# EasyEDA schematic SCH_DART-Flight-Computer-4_2024-07-14.json
TITLE: DART Flight Computer; REV: 4; Date: 2024-07-12; Sheet: 1/1; Drawn By: Jack O'Hara; Company: DART
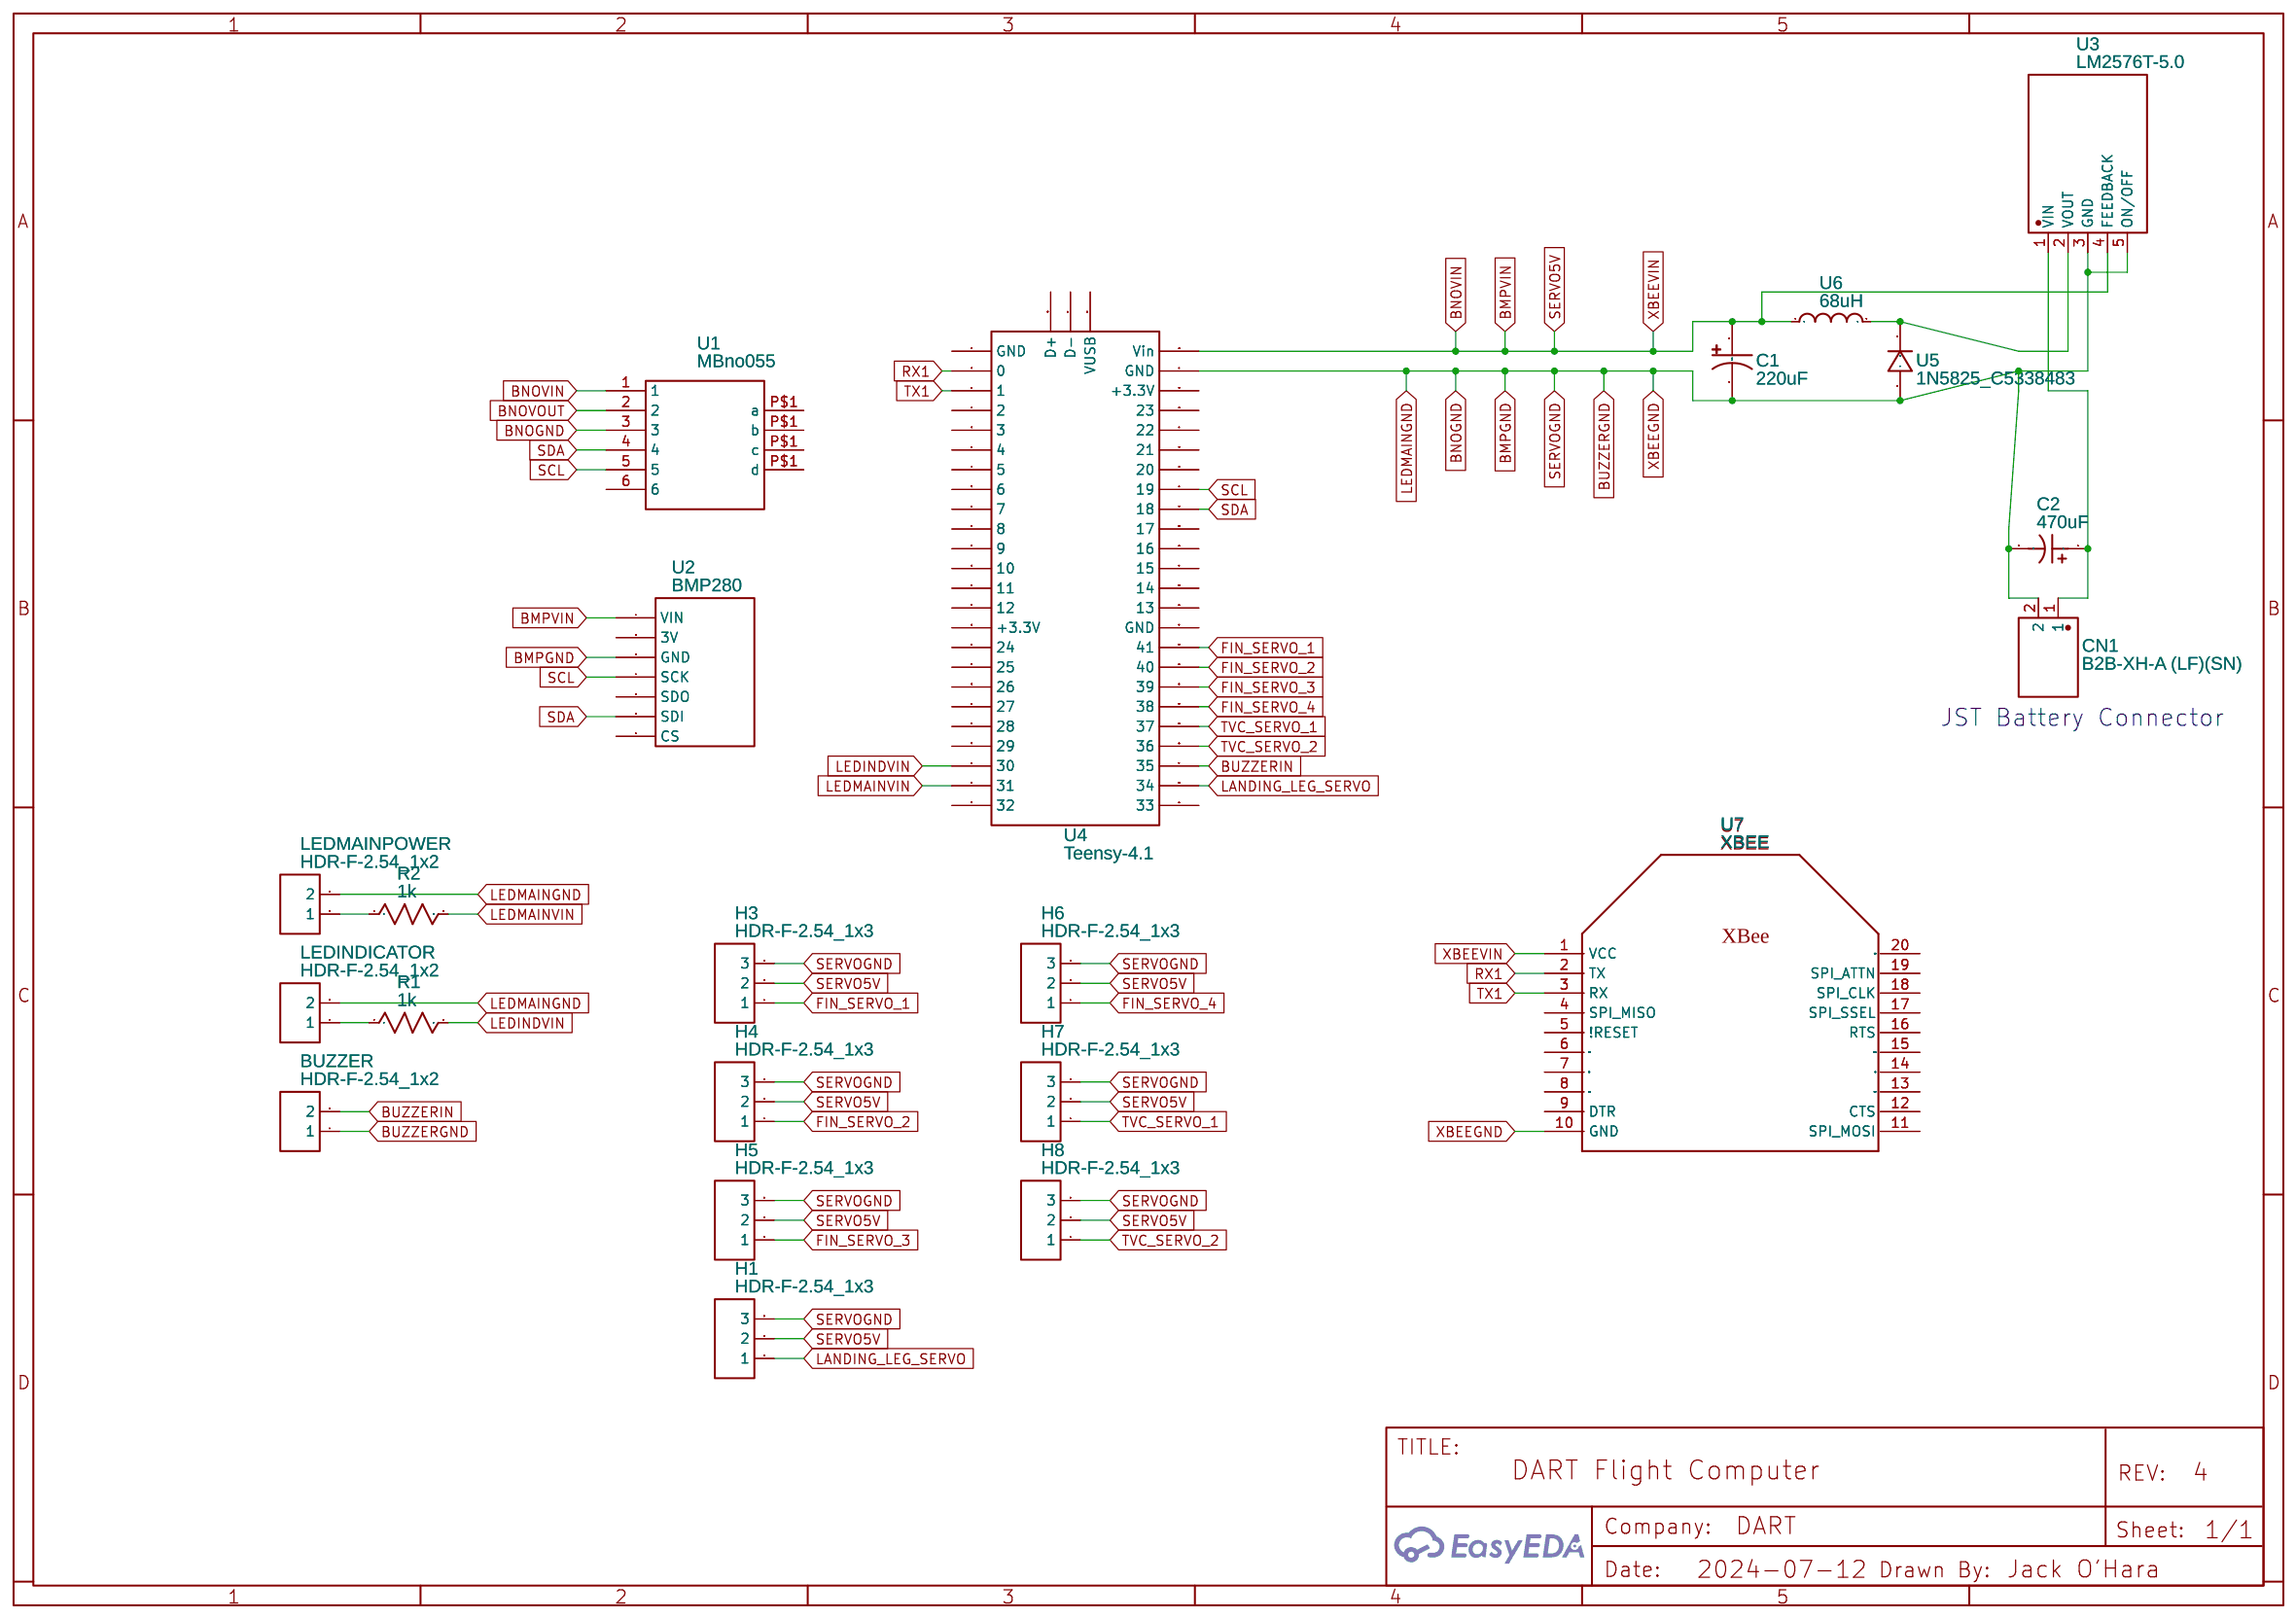
[diagram p0: schematic sheet]

## Parts
BUZZER  HDR-F-2.54_1x2  [HDR-F-2.54_1X2]
C1  220uF  [CAP-TH_BD8.0-P3.50-D0.6-FD]
C2  470uF  [CAP-TH_BD8.0-P3.50-D0.6-FD]
CN1  B2B-XH-A (LF)(SN)  [CONN-TH_B2B-XH-A-LF-SN]
H1  HDR-F-2.54_1x3  [HDR-F-2.54_1X3]
H3  HDR-F-2.54_1x3  [HDR-F-2.54_1X3]
H4  HDR-F-2.54_1x3  [HDR-F-2.54_1X3]
H5  HDR-F-2.54_1x3  [HDR-F-2.54_1X3]
H6  HDR-F-2.54_1x3  [HDR-F-2.54_1X3]
H7  HDR-F-2.54_1x3  [HDR-F-2.54_1X3]
H8  HDR-F-2.54_1x3  [HDR-F-2.54_1X3]
LEDINDICATOR  HDR-F-2.54_1x2  [HDR-F-2.54_1X2]
LEDMAINPOWER  HDR-F-2.54_1x2  [HDR-F-2.54_1X2]
R1  1k  [R0603]
R2  1k  [R0603]
U1  MBno055  [MBNO055]
U2  BMP280  [BMP280YSF BMP280YSF BMP280YSF BMP]
U3  LM2576T-5.0  [TO-220-5L_L10.2-W4.5-P1.71-L]
U4  Teensy-4.1  [TEENSY-4.1-ALL-PINS]
U5  1N5825_C5338483  [DO-201AD_BD5.0-L9.0-P13.00-D1.0]
U6  68uH  [IND-SMD_L12.0-W12.0_SLH1207S100MTT]
U7  XBEE  [XBEE]

## Library data of the parts
BUZZER LEDINDICATOR LEDMAINPOWER = HDR-F-2.54_1x2: Supplier Part: C49661; Supplier: LCSC; Contributor: LCEDA_Lib
C1 = UPW1E221MPD: Contributor: LCSC; Supplier: LCSC; Supplier Part: C225867; Manufacturer: Nichicon(尼吉康); JLCPCB Part Class: Extended Part
C2 = 152EC0399: Supplier: LCSC; Supplier Part: C6718380; Manufacturer: KNSCHA(科尼盛); Contributor: lcsc
CN1 = B2B-XH-A (LF)(SN): Contributor: LCSC; Supplier: LCSC; Supplier Part: C158012; Manufacturer: JST; Manufacturer Part: B2B-XH-A(LF)(SN); JLCPCB Part Class: Extended Part
H1 H3-H8 = HDR-F-2.54_1x3: Supplier Part: C146690; Supplier: LCSC; Contributor: LCEDA_Lib
R1 R2 = R_0603_US: Contributor: LCEDA_Lib
U1 = MBno055: Contributor: ilerimstf.95
U2 = BMP280: Contributor: Calibre320
U3 = LM2576T-5.0: Contributor: LCSC; Supplier: LCSC; Manufacturer: HTC; Supplier Part: C126042; JLCPCB Part Class: Extended Part
U4 = Teensy-4.1: Contributor: vosegaard
U5 = 1N5825_C5338483: Contributor: lcsc; Supplier: LCSC; Supplier Part: C5338483; Manufacturer: SUNMATE(森美特); Manufacturer Part: 1N5825; JLCPCB Part Class: Extended Part
U6 = SRR1210-680M: Supplier: LCSC; Supplier Part: C2041823; Manufacturer: BOURNS; JLCPCB Part Class: Extended Part; Contributor: lcsc
U7 = XBEE: Contributor: signx

## Nets
BMPGND: BUZZER.1 C1.2 C2.2 CN1.2 H1.3 H3.3 H4.3 H5.3 H6.3 H7.3 H8.3 LEDINDICATOR.2 LEDMAINPOWER.2 U1.3 U2.5(GND) U3.3(GND) U3.5(ON/OFF) U4.47(GND) U5.2(A) U7.10(GND)
BMPVIN: C1.1 H1.2 H3.2 H4.2 H5.2 H6.2 H7.2 H8.2 U1.1 U2.7(VIN) U3.4(FEEDBACK) U4.48(Vin) U6.1 U7.1(VCC)
BNOVOUT: U1.2
BUZZERIN: BUZZER.2 U4.27(35)
FIN_SERVO_1: H3.1 U4.33(41)
FIN_SERVO_2: H4.1 U4.32(40)
FIN_SERVO_3: H5.1 U4.31(39)
FIN_SERVO_4: H6.1 U4.30(38)
LANDING_LEG_SERVO: H1.1 U4.26(34)
LEDINDVIN: R1.2 U4.22(30)
LEDMAINVIN: R2.2 U4.23(31)
RX1: U4.2(0) U7.2(TX)
SCL: U1.5 U2.4(SCK) U4.41(19)
SDA: U1.4 U2.2(SDI) U4.40(18)
TVC_SERVO_1: H7.1 U4.29(37)
TVC_SERVO_2: H8.1 U4.28(36)
TX1: U4.3(1) U7.3(RX)
Net-(C2-1): C2.1 CN1.1 U3.1(VIN)
Net-(LEDINDICATOR-1): LEDINDICATOR.1 R1.1
Net-(LEDMAINPOWER-1): LEDMAINPOWER.1 R2.1
Net-(U3-2): U3.2(VOUT) U5.1(C) U6.2

Not connected (* = marked no-connect by the designer): U1 6 P$1(a); U2 1(CS) 3(SDO) 6(3V); U4 1(GND) 4(2) 5(3) 6(4) 7(5) 8(6) 9(7) 10(8) 11(9) 12(10) 13(11) 14(12) 15(+3.3V) 16(24) 17(25) 18(26) 19(27) 20(28) 21(29) 24(32) 25(33) 34(GND) 35(13) 36(14) 37(15) 38(16) 39(17) 42(20) 43(21) 44(22) 45(23) 46(+3.3V) 52(VUSB) 66(D+) 67(D-); U7 4(SPI_MISO) 5(!RESET) 6(PWM0RSSI) 7(PWM1) 8(RESERVED) 9(DTR) 11(SPI_MOSI) 12(CTS) 13(ONSLEEP) 14(VREF) 15(ASCAD5DIO5) 16(RTS) 17(SPI_SSEL) 18(SPI_CLK) 19(SPI_ATTN) 20(AD0DIO0)

## Notes on the sheet
- JST Battery Connector
